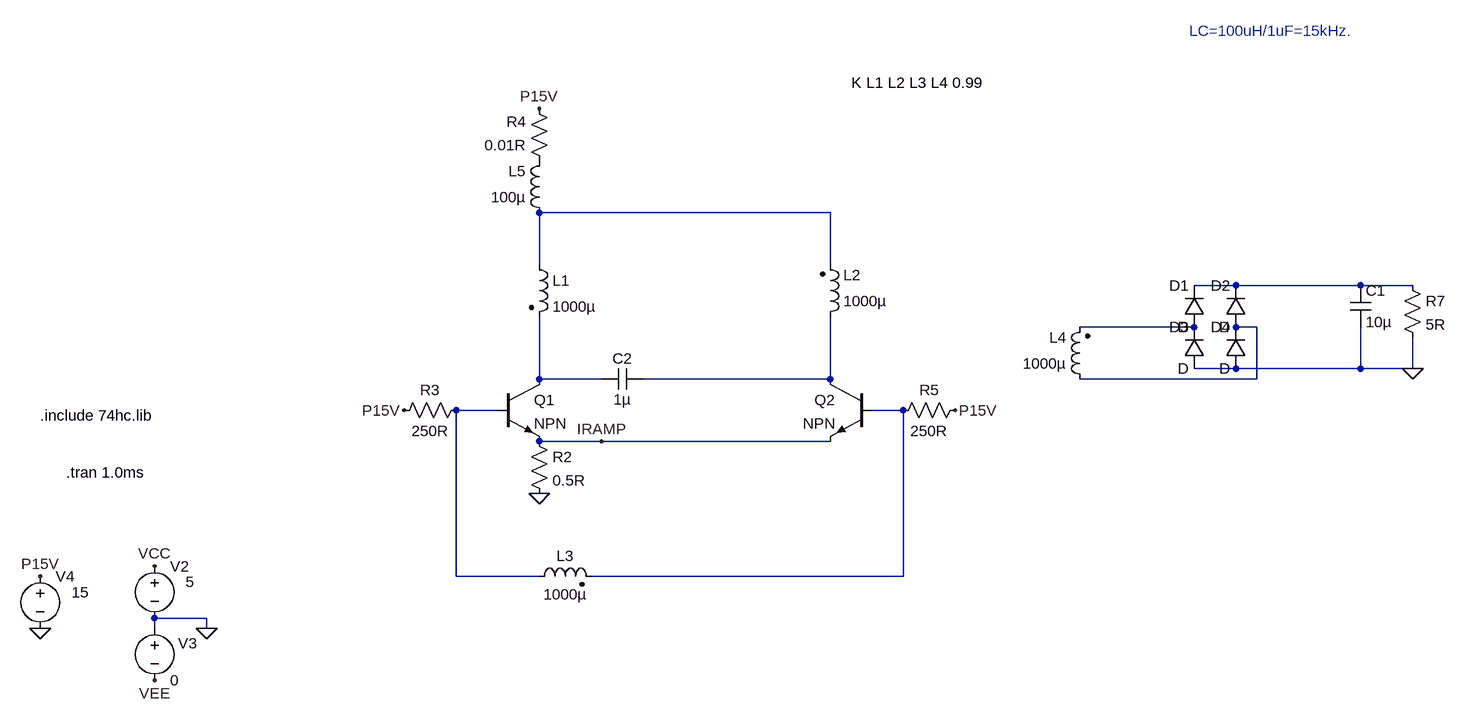
[diagram p0: schematic Draft75.asc]
Draft75.asc, the LTspice schematic file:
Version 4
SHEET 1 3028 1268
WIRE 1872 -672 1424 -672
WIRE 1424 -592 1424 -672
WIRE 1872 -592 1872 -672
WIRE 2496 -560 2432 -560
WIRE 2688 -560 2496 -560
WIRE 2768 -560 2688 -560
WIRE 2432 -496 2256 -496
WIRE 2528 -496 2496 -496
WIRE 2496 -432 2432 -432
WIRE 2688 -432 2688 -496
WIRE 2688 -432 2496 -432
WIRE 2768 -432 2768 -480
WIRE 2768 -432 2688 -432
WIRE 1424 -416 1424 -512
WIRE 1520 -416 1424 -416
WIRE 1872 -416 1872 -512
WIRE 1872 -416 1584 -416
WIRE 2528 -416 2528 -496
WIRE 2528 -416 2256 -416
WIRE 1360 -368 1296 -368
WIRE 1984 -368 1936 -368
WIRE 1520 -320 1424 -320
WIRE 1872 -320 1520 -320
WIRE 1296 -112 1296 -368
WIRE 1424 -112 1296 -112
WIRE 1984 -112 1984 -368
WIRE 1984 -112 1504 -112
WIRE 912 -48 832 -48
WIRE 832 -32 832 -48
WIRE 912 -32 912 -48
FLAG 912 -32 0
FLAG 832 -128 VCC
FLAG 832 48 VEE
FLAG 656 -32 0
FLAG 656 -112 P15V
FLAG 1424 -240 0
FLAG 1424 -832 P15V
FLAG 1520 -320 IRAMP
FLAG 2768 -432 0
FLAG 1216 -368 P15V
FLAG 2064 -368 P15V
SYMBOL voltage 832 -144 R0
WINDOW 123 0 0 Left 0
WINDOW 39 0 0 Left 0
WINDOW 3 48 40 Left 2
SYMATTR Value 5
SYMATTR InstName V2
SYMBOL voltage 832 -48 R0
WINDOW 123 0 0 Left 0
WINDOW 39 0 0 Left 0
WINDOW 0 36 39 Left 2
SYMATTR InstName V3
SYMATTR Value 0
SYMBOL voltage 656 -128 R0
WINDOW 123 0 0 Left 0
WINDOW 39 0 0 Left 0
WINDOW 3 48 40 Left 2
SYMATTR Value 15
SYMATTR InstName V4
SYMBOL ind2 1408 -608 R0
SYMATTR InstName L1
SYMATTR Value 1000µ
SYMATTR Type ind
SYMBOL npn 1360 -416 R0
SYMATTR InstName Q1
SYMBOL res 1408 -336 R0
SYMATTR InstName R2
SYMATTR Value 0.5R
SYMBOL res 1312 -384 R90
WINDOW 0 0 56 VBottom 2
WINDOW 3 32 56 VTop 2
SYMATTR InstName R3
SYMATTR Value 250R
SYMBOL ind2 1856 -496 M180
WINDOW 0 36 80 Left 2
WINDOW 3 36 40 Left 2
SYMATTR InstName L2
SYMATTR Value 1000µ
SYMATTR Type ind
SYMBOL res 1440 -736 R180
WINDOW 0 36 76 Left 2
WINDOW 3 36 40 Left 2
SYMATTR InstName R4
SYMATTR Value 0.01R
SYMBOL ind2 1408 -96 R270
WINDOW 0 32 56 VTop 2
WINDOW 3 4 56 VBottom 2
SYMATTR InstName L3
SYMATTR Value 1000µ
SYMATTR Type ind
SYMBOL npn 1936 -416 M0
SYMATTR InstName Q2
SYMBOL res 1968 -352 R270
WINDOW 0 32 56 VTop 2
WINDOW 3 0 56 VBottom 2
SYMATTR InstName R5
SYMATTR Value 250R
SYMBOL diode 2448 -496 R180
WINDOW 0 24 64 Left 2
WINDOW 3 24 0 Left 2
SYMATTR InstName D1
SYMBOL diode 2512 -496 R180
WINDOW 0 24 64 Left 2
WINDOW 3 24 0 Left 2
SYMATTR InstName D2
SYMBOL diode 2448 -432 R180
WINDOW 0 24 64 Left 2
WINDOW 3 24 0 Left 2
SYMATTR InstName D3
SYMBOL diode 2512 -432 R180
WINDOW 0 24 64 Left 2
WINDOW 3 24 0 Left 2
SYMATTR InstName D4
SYMBOL cap 2672 -560 R0
SYMATTR InstName C1
SYMATTR Value 10µ
SYMBOL res 2752 -576 R0
SYMATTR InstName R7
SYMATTR Value 5R
SYMBOL cap 1584 -432 R90
WINDOW 0 0 32 VBottom 2
WINDOW 3 32 32 VTop 2
SYMATTR InstName C2
SYMATTR Value 1µ
SYMBOL ind 1440 -656 R180
WINDOW 0 36 80 Left 2
WINDOW 3 36 40 Left 2
SYMATTR InstName L5
SYMATTR Value 100µ
SYMBOL ind2 2272 -400 R180
WINDOW 0 36 80 Left 2
WINDOW 3 36 40 Left 2
SYMATTR InstName L4
SYMATTR Value 1000µ
SYMATTR Type ind
TEXT 696 -272 Left 2 !.tran 1.0ms
TEXT 656 -360 Left 2 !.include 74hc.lib
TEXT 1904 -872 Left 2 !K L1 L2 L3 L4 0.99
TEXT 2424 -952 Left 2 ;LC=100uH/1uF=15kHz.

The netlist it stands for:
* Draft75.asc
V2 VCC 0 5
V3 0 VEE 0
V4 P15V 0 15
L1 N001 N005 1000µ
Q1 N005 N007 IRAMP 0 NPN
R2 IRAMP 0 0.5R
R3 N007 P15V 250R
L2 N006 N001 1000µ
R4 P001 P15V 0.01R
L3 N007 N008 1000µ
Q2 N006 N008 IRAMP 0 NPN
R5 N008 P15V 250R
D1 N003 N002 D
D2 N004 N002 D
D3 0 N003 D
D4 0 N004 D
C1 N002 0 10µ
R7 N002 0 5R
C2 N006 N005 1µ
L5 N001 P001 100µ
L4 N004 N003 1000µ
.model D D
.lib standard.dio
.model NPN NPN
.model PNP PNP
.lib standard.bjt
.tran 1.0ms
.include 74hc.lib
K L1 L2 L3 L4 0.99
* LC=100uH/1uF=15kHz.
.backanno
.end